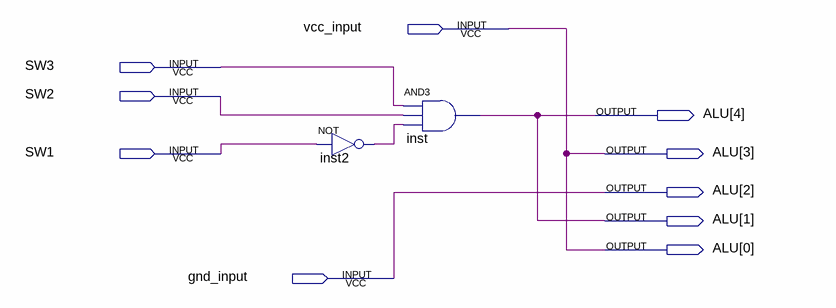
[diagram p0: schematic sheet]
// Quartus schematic control_alu.bdf as structural Verilog: 2 symbols, 10 pins
module control_alu (
  input  vcc_input,
  input  SW3,
  input  SW2,
  input  SW1,
  input  gnd_input,
  output [4:0] ALU
);

  wire inst2_out;

  not inst2 (inst2_out, SW1);
  and inst (ALU[4], SW3, SW2, inst2_out);

  assign ALU[3:0] = {vcc_input, gnd_input, ALU[4], vcc_input};
endmodule
